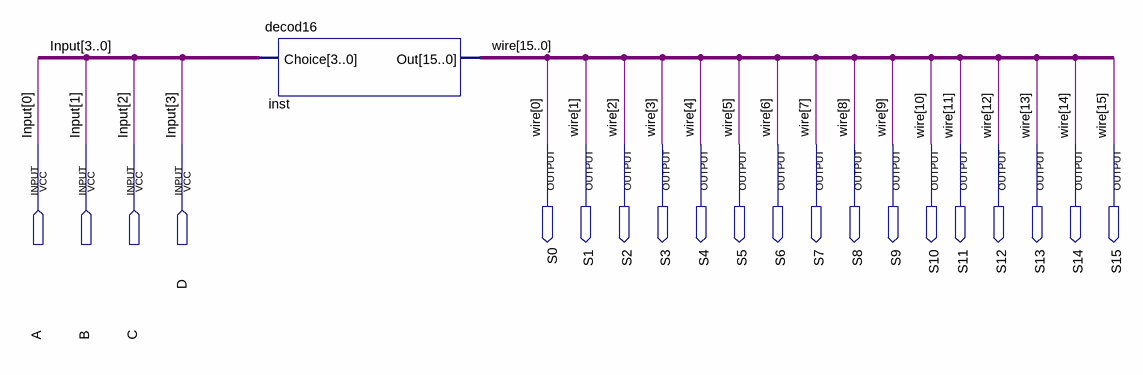
[diagram p0: schematic sheet]
// Quartus schematic decod16Simul.bdf as structural Verilog: 1 symbols, 20 pins
module decod16Simul (
  input  A,
  input  B,
  input  C,
  input  D,
  output S0,
  output S1,
  output S2,
  output S3,
  output S4,
  output S5,
  output S6,
  output S7,
  output S8,
  output S9,
  output S10,
  output S11,
  output S12,
  output S13,
  output S14,
  output S15
);

  decod16 inst (.Choice({D, C, B, A}), .Out({S15, S14, S13, S12, S11, S10, S9, S8, S7, S6, S5, S4, S3, S2, S1, S0}));

  // Other names for the same wires on the sheet: Input[3:0] = {D, C, B, A};
  //   wire[15:0] = {S15, S14, S13, S12, S11, S10, S9, S8, S7, S6, S5, S4, S3, S2, S1, S0}
endmodule
